# Altium schematic sheet sch_Connet&IMU.SchDoc
size A4
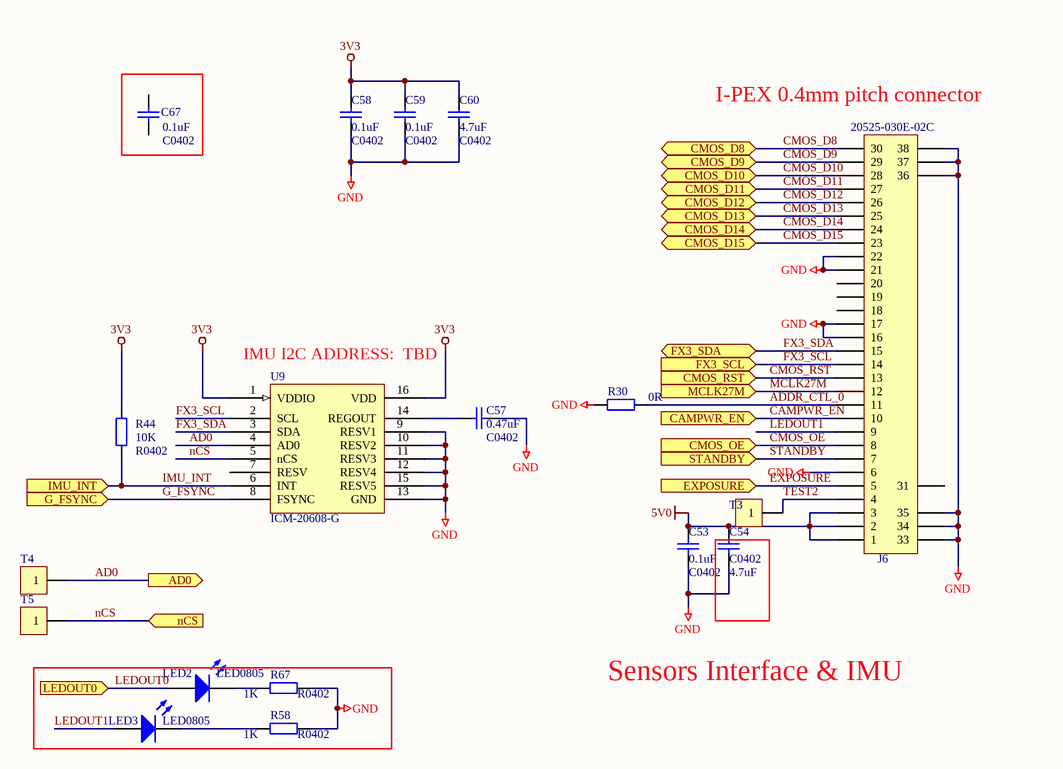
[diagram p0: sch_Connet&IMU.SchDoc]

## Parts
C53  0.1uF  value C0402  [0402C]
C54  4.7uF  value C0402  [0402C]
C57  0.47uF  value C0402  [0402C]
C58  0.1uF  value C0402  [0402C]
C59  0.1uF  value C0402  [0402C]
C60  4.7uF  value C0402  [0402C]
C67  0.1uF  value C0402  [0402C]
J6  20525-030E-02C  [HSA30_P40L196W42H10_20525]
LED2  LED0805  [LED0805A_L210W100H60]
LED3  LED0805  [LED0805A_L210W100H60]
R30  0R  [0402R]
R44  10K  value R0402  [0402R]
R58  1K  value R0402  [0402R]
R67  1K  value R0402  [0402R]
T3  CON1  [PAD_TP_D1.2]  (value not drawn)
T4  CON1  [PAD_TP_D1.2]  (value not drawn)
T5  CON1  [PAD_TP_D1.2]  (value not drawn)
U9  ICM-20608-G  [LGA16_P50L30W30H08]

## Ports
AD0 (out), CAMPWR_EN (in), CMOS_D8 (bidir), CMOS_D9 (bidir), CMOS_D10 (bidir), CMOS_D11 (bidir), CMOS_D12 (bidir), CMOS_D13 (bidir), CMOS_D14 (bidir), CMOS_D15 (bidir), CMOS_OE (in), CMOS_RST (in), EXPOSURE (in), FX3_SCL (in), FX3_SDA (bidir), G_FSYNC (in), IMU_INT (in), LEDOUT0 (in), MCLK27M (in), nCS (in), STANDBY (in)

## Nets
3V3: C58.2 C59.2 C60.2 R44.2 U9.1(VDDIO) U9.16(VDD)
5V0: C53.2 C54.2 J6.1 J6.2 J6.3
GND: C53.1 C54.1 C57.1 C58.1 C59.1 C60.1 J6.6 J6.16 J6.17 J6.21 J6.22 J6.33 J6.34 J6.35 J6.36 J6.37 J6.38 R30.2 R58.1 R67.1 U9.9(RESV1) U9.10(RESV2) U9.11(RESV3) U9.12(RESV4) U9.13(GND) U9.15(RESV5)
AD0: T4.1 U9.4(AD0) ; port AD0
ADDR_CTL_0: J6.11 R30.1
CAMPWR_EN: J6.10 ; port CAMPWR_EN
CMOS_D8: J6.30 ; port CMOS_D8
CMOS_D9: J6.29 ; port CMOS_D9
CMOS_D10: J6.28 ; port CMOS_D10
CMOS_D11: J6.27 ; port CMOS_D11
CMOS_D12: J6.26 ; port CMOS_D12
CMOS_D13: J6.25 ; port CMOS_D13
CMOS_D14: J6.24 ; port CMOS_D14
CMOS_D15: J6.23 ; port CMOS_D15
CMOS_OE: J6.8 ; port CMOS_OE
CMOS_RST: J6.13 ; port CMOS_RST
EXPOSURE: J6.5 ; port EXPOSURE
FX3_SCL: J6.14 U9.2(SCL) ; port FX3_SCL
FX3_SDA: J6.15 U9.3(SDA) ; port FX3_SDA
G_FSYNC: U9.8(FSYNC) ; port G_FSYNC
IMU_INT: R44.1 U9.6(INT) ; port IMU_INT
LEDOUT0: LED2.1(A) ; port LEDOUT0
LEDOUT1: J6.9 LED3.1(A)
MCLK27M: J6.12 ; port MCLK27M
nCS: T5.1 U9.5(nCS) ; port nCS
STANDBY: J6.7 ; port STANDBY
TEST2: J6.4 T3.1
NetC57_2: C57.2 U9.14(REGOUT)
NetLED2_2: LED2.2(K) R67.2
NetLED3_2: LED3.2(K) R58.2

Not connected (* = marked no-connect by the designer): C67 1 2; J6 18 19 20 31; U9 7(RESV)

## Notes on the sheet
- (near J6) I-PEX 0.4mm pitch connector
- (near U9) IMU I2C ADDRESS:  TBD
- Sensors Interface & IMU

## Library data of the parts
C53 C54 C57-C60 C67 = Cap: Capacitor; Published: 8-Jun-2000; LatestRevisionDate: 17-Jul-2002; LatestRevisionNote: Re-released for DXP Platform.; PackageReference: RAD-0.3; Publisher: Altium Limited
LED2 LED3 = LED: 发光二级管
R30 R44 R58 R67 = Res2: Resistor; Published: 8-Jun-2000; LatestRevisionDate: 17-Jul-2002; LatestRevisionNote: Re-released for DXP Platform.; PackageReference: AXIAL-0.4; Publisher: Altium Limited
  R30: Value: 0R
T3-T5 = CON1: Connector